# EAGLE schematic busboard (EAGLE 9.6.2)
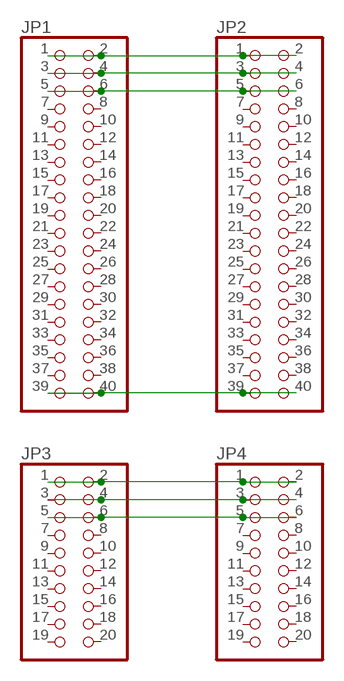
[diagram p0: schematic, sheet 1]

## Parts
JP1  PINHD-2X20  [2X20]
JP2  PINHD-2X20  [2X20]
JP3  PINHD-2X10  [2X10]
JP4  PINHD-2X10  [2X10]

## Nets
N$1: JP1.1 JP1.2 JP2.1 JP2.2
N$3: JP1.3 JP1.4 JP2.3 JP2.4
N$5: JP1.5 JP1.6 JP2.5 JP2.6
N$7: JP1.39 JP1.40 JP2.39 JP2.40
N$9: JP3.1 JP3.2 JP4.1 JP4.2
N$10: JP3.3 JP3.4 JP4.3 JP4.4
N$11: JP3.5 JP3.6 JP4.5 JP4.6
Unconnected: JP1.7 JP1.8 JP1.9 JP1.10 JP1.11 JP1.12 JP1.13 JP1.14 JP1.15 JP1.16 JP1.17 JP1.18 JP1.19 JP1.20 JP1.21 JP1.22 JP1.23 JP1.24 JP1.25 JP1.26 JP1.27 JP1.28 JP1.29 JP1.30 JP1.31 JP1.32 JP1.33 JP1.34 JP1.35 JP1.36 JP1.37 JP1.38 JP2.7 JP2.8 JP2.9 JP2.10 JP2.11 JP2.12 JP2.13 JP2.14 JP2.15 JP2.16 JP2.17 JP2.18 JP2.19 JP2.20 JP2.21 JP2.22 JP2.23 JP2.24 JP2.25 JP2.26 JP2.27 JP2.28 JP2.29 JP2.30 JP2.31 JP2.32 JP2.33 JP2.34 JP2.35 JP2.36 JP2.37 JP2.38 JP3.7 JP3.8 JP3.9 JP3.10 JP3.11 JP3.12 JP3.13 JP3.14 JP3.15 JP3.16 JP3.17 JP3.18 JP3.19 JP3.20 JP4.7 JP4.8 JP4.9 JP4.10 JP4.11 JP4.12 JP4.13 JP4.14 JP4.15 JP4.16 JP4.17 JP4.18 JP4.19 JP4.20

## Library data of the parts
JP1 JP2 = pinhead:PINHD-2X20: PIN HEADER
JP3 JP4 = pinhead:PINHD-2X10: PIN HEADER